# EAGLE board Stealthboard TMC2100 (EAGLE 8.1.0), part 1 of 2
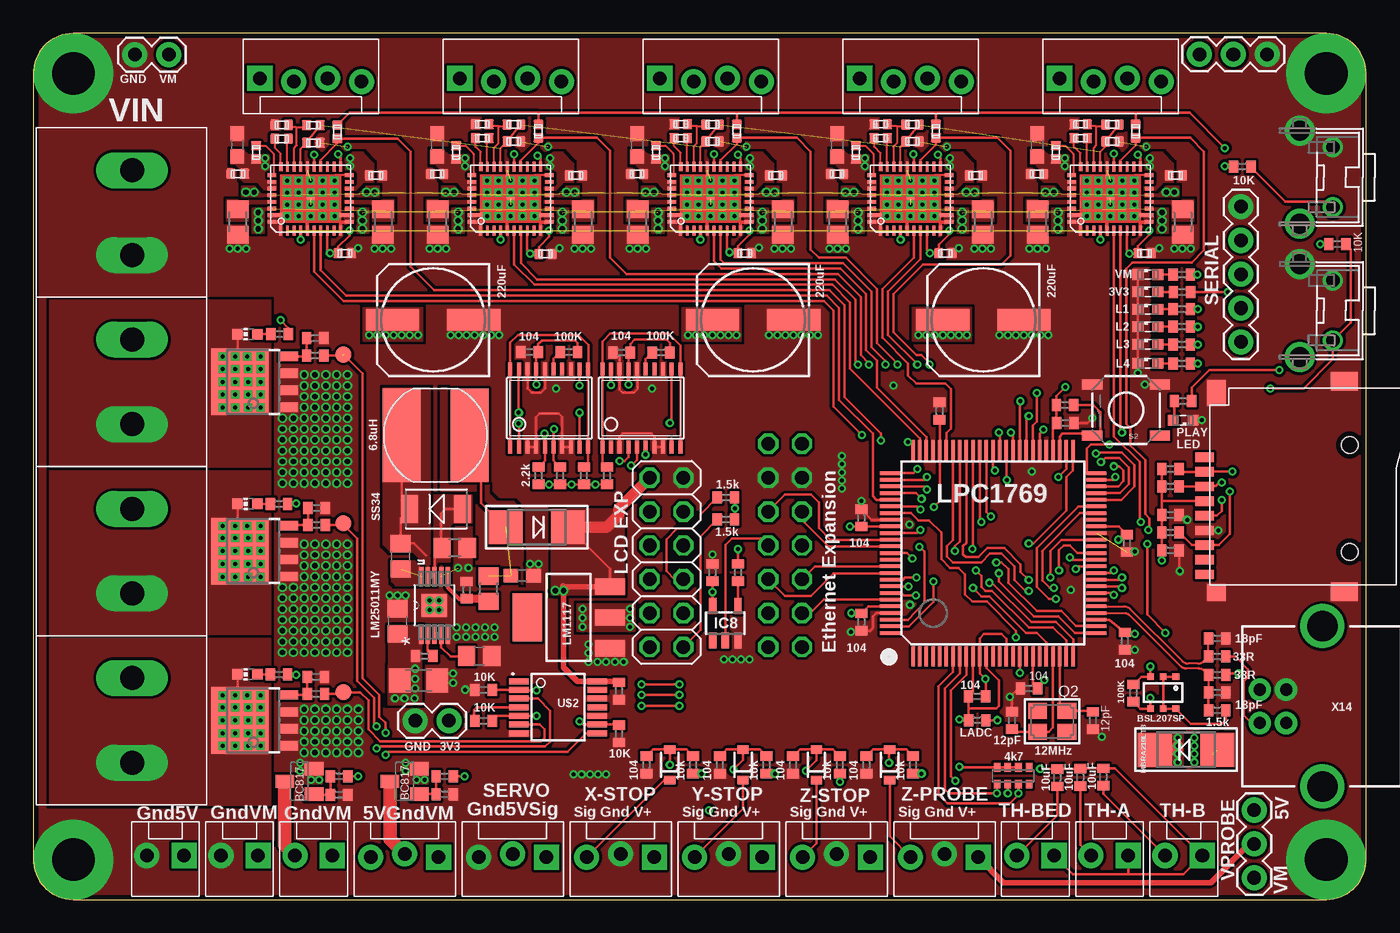
[diagram p8: board, top side]
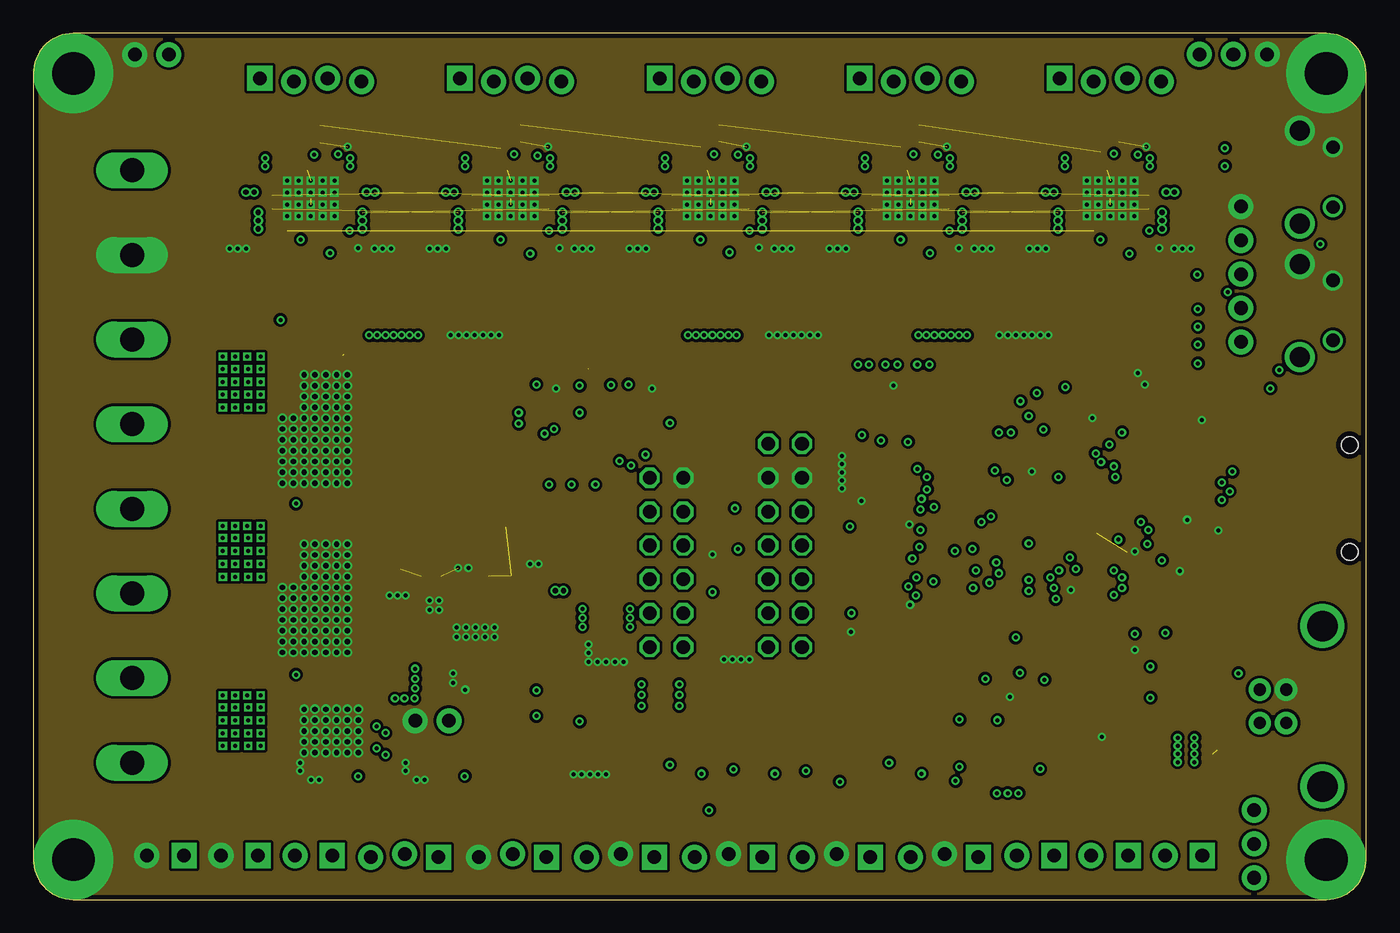
[diagram p9: board, inner layer GND]
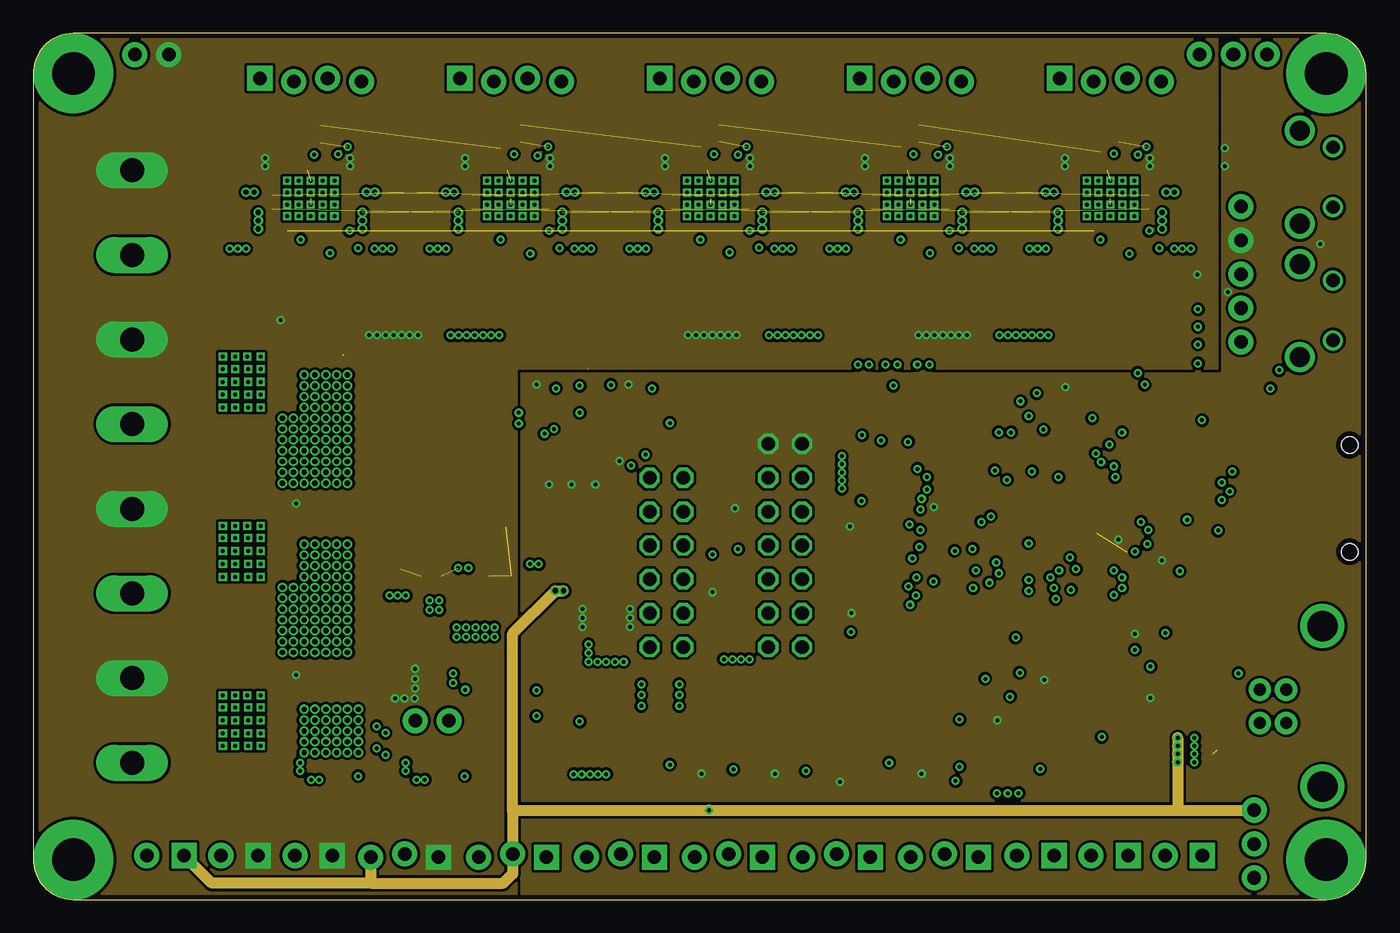
[diagram p10: board, inner layer VCC]
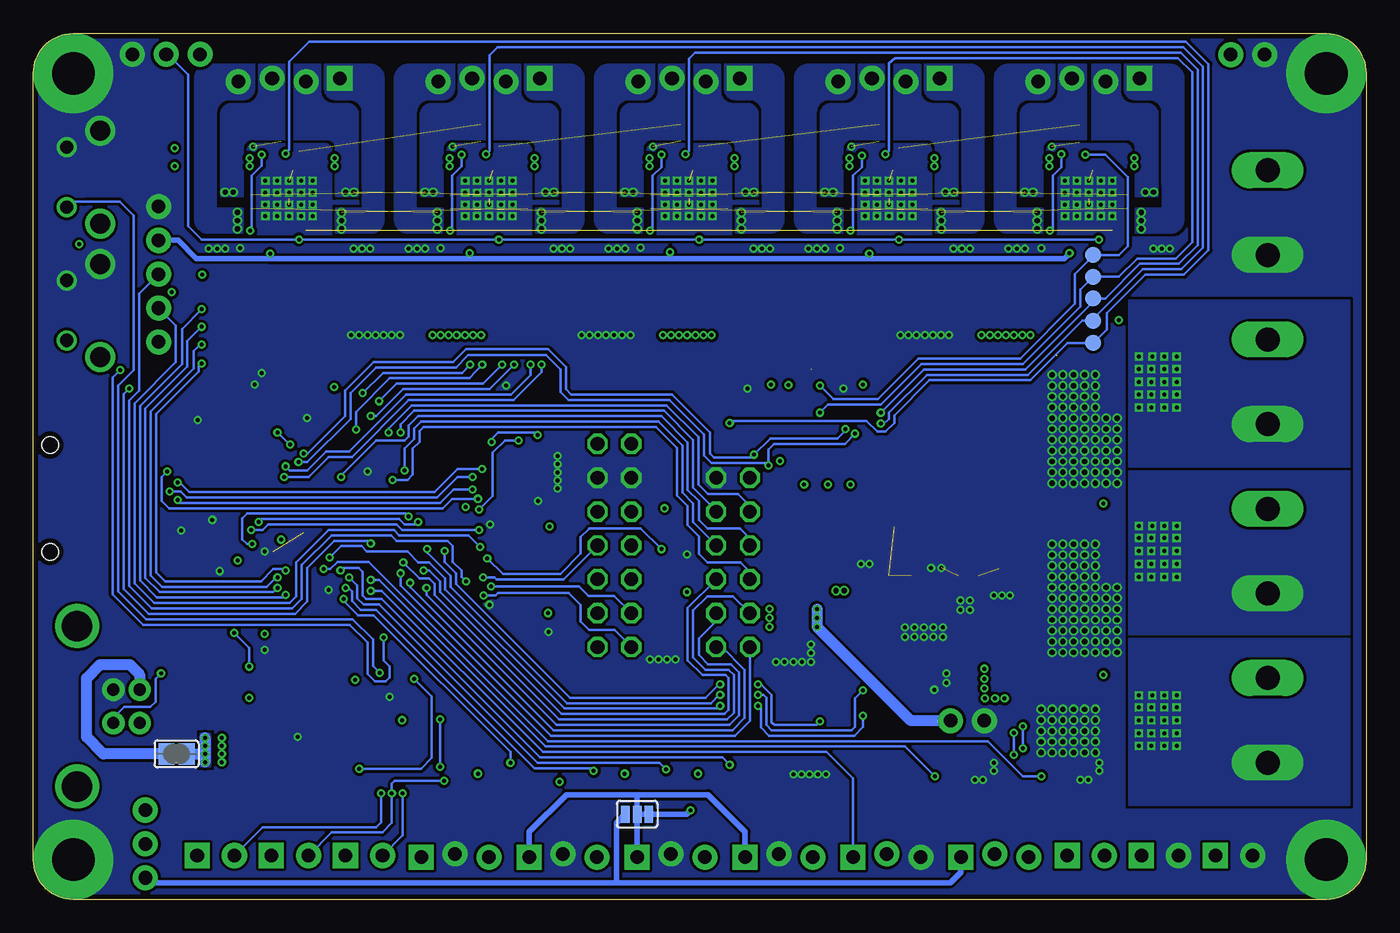
[diagram p11: board, bottom side, seen from below]

Size 100 x 65 mm. Coordinates in mm from the lower left corner, seen from the top.
Outline: 3,0 97,0 arc90 100,3 100,62 arc90 97,65 3,65 arc90 0,62 0,3 arc90 3,0
Copper layers (1*2*15*16): Top 0.035559375mm / dielectric 0.17018125mm / GND 0.01778125mm / dielectric 47mil / VCC 0.01778125mm / dielectric 0.17018125mm / Bottom 0.035559375mm
Design rules "OSHPark-4layer *": minimum track width 6mil, minimum drill 0.3mm, track to track 8mil, track to pad 8mil, pad to pad 6mil, via to via 6mil, smd to smd 0mil, copper to edge 15mil, drill to drill 6mil, minimum pad ring 4mil, minimum via ring 6mil, stop-mask expansion 2.5mil, vias tented up to drill 20mil, thermal gap 10mil
Net classes: 5 3.3-Amp Class: width 1.27 mm

## Footprints (pad centres in the part's own frame; a part is rotated, then mirrored left to right if it is on the bottom)
SML0603 = smd 0.8 x 0.8: A 0.75,0; C -0.75,0
C0402 = smd 0.7 x 0.9: 1 -0.65,0; 2 0.65,0
C0402' = smd 0.75 x 0.7: 1 0,0.5; 2 0,-0.5
C0805 = smd 1.3 x 1.5: 1 -0.95,0; 2 0.95,0
C1206 = smd 1.6 x 1.8: 1 -1.4,0; 2 1.4,0
C0603 = smd 1.1 x 1: 1 -0.85,0; 2 0.85,0
153CLV-0807 = smd 4 x 1.6: + 3.05,0; - -3.05,0
SMADIODE = smd 2.54 x 2.54: A 2.349,0; C -2.349,0
DO-214AC = smd 1.27 x 2.1: 1 -1.98,0; 2 1.98,0
SOD-323 = smd 0.63 x 0.83: A 1.15,0; C -1.15,0
LQFP100 = smd 0.27 x 1.5: 1 -6,-7.75; 2 -5.5,-7.75; 3 -5,-7.75; 4 -4.5,-7.75; 5 -4,-7.75; 6 -3.5,-7.75; 7 -3,-7.75; 8 -2.5,-7.75; 9 -2,-7.75; 10 -1.5,-7.75; 11 -1,-7.75; 12 -0.5,-7.75; 13 0,-7.75; 14 0.5,-7.75; 15 1,-7.75; 16 1.5,-7.75; 17 2,-7.75; 18 2.5,-7.75; 19 3,-7.75; 20 3.5,-7.75; 21 4,-7.75; 22 4.5,-7.75; 23 5,-7.75; 24 5.5,-7.75; 25 6,-7.75; 51 6,7.75; 52 5.5,7.75; 53 5,7.75; 54 4.5,7.75; 55 4,7.75; 56 3.5,7.75; 57 3,7.75; 58 2.5,7.75; 59 2,7.75; 60 1.5,7.75; 61 1,7.75; 62 0.5,7.75; 63 0,7.75; 64 -0.5,7.75; 65 -1,7.75; 66 -1.5,7.75; 67 -2,7.75; 68 -2.5,7.75; 69 -3,7.75; 70 -3.5,7.75; 71 -4,7.75; 72 -4.5,7.75; 73 -5,7.75; 74 -5.5,7.75; 75 -6,7.75 | smd 1.5 x 0.27: 26 7.75,-6; 27 7.75,-5.5; 28 7.75,-5; 29 7.75,-4.5; 30 7.75,-4; 31 7.75,-3.5; 32 7.75,-3; 33 7.75,-2.5; 34 7.75,-2; 35 7.75,-1.5; 36 7.75,-1; 37 7.75,-0.5; 38 7.75,0; 39 7.75,0.5; 40 7.75,1; 41 7.75,1.5; 42 7.75,2; 43 7.75,2.5; 44 7.75,3; 45 7.75,3.5; 46 7.75,4; 47 7.75,4.5; 48 7.75,5; 49 7.75,5.5; 50 7.75,6; 76 -7.75,6; 77 -7.75,5.5; 78 -7.75,5; 79 -7.75,4.5; 80 -7.75,4; 81 -7.75,3.5; 82 -7.75,3; 83 -7.75,2.5; 84 -7.75,2; 85 -7.75,1.5; 86 -7.75,1; 87 -7.75,0.5; 88 -7.75,0; 89 -7.75,-0.5; 90 -7.75,-1; 91 -7.75,-1.5; 92 -7.75,-2; 93 -7.75,-2.5; 94 -7.75,-3; 95 -7.75,-3.5; 96 -7.75,-4; 97 -7.75,-4.5; 98 -7.75,-5; 99 -7.75,-5.5; 100 -7.75,-6
QFN36-PAD = smd 0.7 x 0.26: 1 -2.4,2.25; 2 -2.4,1.75; 3 -2.4,1.25; 4 -2.4,0.75; 5 -2.4,0.25; 6 -2.4,-0.25; 7 -2.4,-0.75; 8 -2.4,-1.25; 9 -2.4,-1.75; 10 -2.4,-2.25; 19 2.4,-2.25; 20 2.4,-1.75; 21 2.4,-1.25; 22 2.4,-0.75; 23 2.4,-0.25; 25 2.4,0.75; 26 2.4,1.25; 27 2.4,1.75; 28 2.4,2.25 | smd 0.26 x 0.7: 11 -1.75,-2.9; 13 -0.75,-2.9; 14 -0.25,-2.9; 15 0.25,-2.9; 16 0.75,-2.9; 17 1.25,-2.9; 18 1.75,-2.9; 29 1.75,2.9; 30 1.25,2.9; 31 0.75,2.9; 32 0.25,2.9; 33 -0.25,2.9; 34 -0.75,2.9; 36 -1.75,2.9 | smd 0.26 x 1.2: 12 -1.25,-2.65; 35 -1.25,2.65 | smd 1.2 x 0.26: 24 2.15,0.25 | smd 0.6 x 0.6: TP 0,0
TSSOP20 = smd 0.305 x 0.991: 1 -2.925,-2.918; 2 -2.275,-2.918; 3 -1.625,-2.918; 4 -0.975,-2.918; 5 -0.325,-2.918; 6 0.325,-2.918; 7 0.975,-2.918; 8 1.625,-2.918; 9 2.275,-2.918; 10 2.925,-2.918; 11 2.925,2.918; 12 2.275,2.918; 13 1.625,2.918; 14 0.975,2.918; 15 0.325,2.918; 16 -0.325,2.918; 17 -0.975,2.918; 18 -1.625,2.918; 19 -2.275,2.918; 20 -2.925,2.918
SOT23-5 = smd 0.55 x 1.2: 1 -0.95,-1.3; 2 0,-1.3; 3 0.95,-1.3; 4 0.95,1.3; 5 -0.95,1.3
CD75 = smd 7 x 2.85: 1 0,2.54; 2 0,-2.54
MOLEX-1X2_LOCK = drill 1.016 pad 1.88 square: 1 -0.127,0 | drill 1.016 pad 1.88: 2 2.667,0
MOLEX-1X3_LOCK = drill 1.016 pad 1.88 square: 1 0,0.127 | drill 1.016 pad 1.88: 2 2.54,-0.127; 3 5.08,0.127
1X05 = drill 1.016 pad 1.88: 1 0,0; 2 2.54,0; 3 5.08,0; 4 7.62,0; 5 10.16,0
1X03 = drill 1.016 pad 1.88: 1 0,0; 2 2.54,0; 3 5.08,0
2X06 = drill 1.016 octagon: 1 -6.35,-1.27; 2 -6.35,1.27; 3 -3.81,-1.27; 4 -3.81,1.27; 5 -1.27,-1.27; 6 -1.27,1.27; 7 1.27,-1.27; 8 1.27,1.27; 9 3.81,-1.27; 10 3.81,1.27; 11 6.35,-1.27; 12 6.35,1.27
MOLEX-1X4_LOCK = drill 1.016 pad 1.88 square: 1 0,0.127 | drill 1.016 pad 1.88: 2 2.54,-0.127; 3 5.08,0.127; 4 7.62,-0.127
1X02 = drill 1.016 pad 1.88: 1 0,0; 2 2.54,0
2X07 = drill 1.016 octagon: 1 -7.62,-1.27; 2 -7.62,1.27; 3 -5.08,-1.27; 4 -5.08,1.27; 5 -2.54,-1.27; 6 -2.54,1.27; 7 0,-1.27; 8 0,1.27; 9 2.54,-1.27; 10 2.54,1.27; 11 5.08,-1.27; 12 5.08,1.27; 13 7.62,-1.27; 14 7.62,1.27
L0402_LPT = smd 0.7 x 0.9: 1 -0.65,0; 2 0.65,0
CHIP-LED0603 = smd 0.8 x 0.8: A 0,-0.75; C 0,0.75
SC74_INFINEON = smd 0.5 x 0.5: 1 -0.95,-1.2; 2 0,-1.2; 3 0.95,-1.2; 4 0.95,1.2; 5 0,1.2; 6 -0.95,1.2
CRYSTAL_3.2X2.5 = smd 1.4 x 1.2: 1 -1.1,-0.8; 2 1.1,0.8; GND1 -1.1,0.8; GND2 1.1,-0.8
SOT669 = smd 0.7 x 1.4: 1 -1.905,-2.65; 2 -0.635,-2.65; 3 0.635,-2.65; 4 1.905,-2.65 | smd 5 x 4.3: MB 0,1
R0402 = smd 0.7 x 0.9: 1 -0.65,0; 2 0.65,0
M0805 = smd 1.3 x 1.6: 1 -0.95,0; 2 0.95,0
R0805 = smd 1.3 x 1.5: 1 -0.95,0; 2 0.95,0
0603-ARV = smd 0.5 x 0.65: 1 -1.2,-0.625; 2 -0.4,-0.625; 3 0.4,-0.625; 4 1.2,-0.625; 5 1.2,0.625; 6 0.4,0.625; 7 -0.4,0.625; 8 -1.2,0.625
TACTILE_SWITCH_SMD = smd 1.524 x 0.762: 1 -2.54,1.905; 2 2.54,1.905; 3 -2.54,-1.905; 4 2.54,-1.905
TF-PULL = smd 0.7 x 1.4: 1 -2.2,-7.62; 2 -1.1,-7.62; 3 0,-7.62; 4 1.1,-7.62; 5 2.2,-7.62; 6 3.3,-7.62; 7 4.4,-7.62; 8 5.5,-7.62; 9 6.6,-7.62 | smd 1.4 x 2: S1 -7.9,2.85; S2 7.9,2.85 | smd 1.28 x 1.4: S3 7.96,-6.75 | smd 1.95 x 1.4: S4 -7.025,-6.75 | hole 1.25: -3.1,3.25; 4.9,3.25
SJ = smd 1.168 x 1.6: 1 -0.762,0; 2 0.762,0
SJ_3 = smd 0.635 x 1.27: 1 -0.889,0; 2 0,0; 3 0.889,0
SW_TACT_STANDARD_RIGHT_ANGLE = drill 1: 1 -2.25,0; 2 2.25,0 | drill 1.5: 3 -3.5,2.5; 4 3.5,2.5
SOT23-BEC = smd 1 x 1.4: B -0.95,-1.1; C 0,1.1; E 0.95,-1.1
SOP50P490X110-11N = smd 1.372 x 0.33: 1 -2.21,0.991; 2 -2.21,0.508; 3 -2.21,0; 4 -2.21,-0.508; 5 -2.21,-0.991; 6 2.21,-0.991; 7 2.21,-0.508; 8 2.21,0; 9 2.21,0.508; 10 2.21,0.991 | smd 1.727 x 1.905: 11 0,0
SOT223 = smd 1.219 x 2.235: 1 -2.311,-3.099; 2 0,-3.099; 3 2.311,-3.099 | smd 3.6 x 2.2: 4 0,3.099
KF635-6.35MM = drill 1.8 long: P$1 7.2,3.175; P$2 7.2,9.525
TSSOP-14 = smd 1.45 x 0.45: 1 -2.95,1.95; 2 -2.95,1.3; 3 -2.95,0.65; 4 -2.95,0; 5 -2.95,-0.65; 6 -2.95,-1.3; 7 -2.95,-1.95; 8 2.95,-1.95; 9 2.95,-1.3; 10 2.95,-0.65; 11 2.95,0; 12 2.95,0.65; 13 2.95,1.3; 14 2.95,1.95
SMALL_PAD = smd 1.2 x 1.2: P$1 0,0
USB-B-PTH = drill 0.914 pad 1.676: D+ 0,1.25; D- 1.981,1.25; GND 0,-1.25; VBUS 1.981,-1.25 | drill 2.286: S1 -2.718,-6.02; S2 -2.718,6.02

## Placement (x,y rotation side)
3V3  RED  [SML0603]  83.62,45.59 0 top
C1  104  [C0402]  46,10.1 90 top
C2  12pF  [C0402]  73.42,13.45 90 top
C3  12pF  [C0402]  79.5,13.43 270 top
C4  18pF  [C0402]  88.82,19.6 180 top
C5  18pF  [C0402]  88.82,15.54 180 top
C6  104  [C0402]  70.81,15.25 0 top
C7  104  [C0402]  62.12,20.82 90 top
C8  104  [C0402]  85.32,28.86 180 top
C9  104  [C0402]  77.41,35.76 180 top
C10  104  [C0402]  74.71,15.84 0 top
C11  104  [C0402]  82.05,26.73 90 top
C12  104  [C0402]  62.12,28.64 270 top
C13  100n/50V  [C0402']  15.34,54.46 270 top
C14  10uF  [C0402]  76.82,9.15 90 top
C15  10uF  [C0402]  80.27,9.2 90 top
C16  1uF  [C0805]  27.33,20.88 90 top
C17  104  [C0402]  81.88,19.39 90 top
C19  104  [C0402]  51.5,10.1 90 top
C20  104  [C0402]  67.98,36.66 270 top
C21  104  [C0402]  57,10.1 90 top
C22  104  [C0402]  62.5,10.1 90 top
C23  2.2uF  [C1206]  28.91,16.46 0 top
C24  104  [C0805]  33.45,18.26 180 top
C25  104  [C0805]  27.56,25.76 90 top
C26  10uF  [C0603]  36.68,24.31 0 top
C27  1u/50V  [C0603]  15.31,56.62 90 top
C28  100n/50V  [C0402']  23.38,48.49 270 top
C29  470n/10V  [C0402']  18.63,58.13 90 top
C30  4u7/10V  [C0402']  21.01,56.79 270 top
C32  100n/50V  [C0402']  25.71,54.34 90 top
C33  100n/50V  [C0402']  16.71,56.07 180 top
C34  22n/50V  [C0402']  18.63,57.08 270 top
C35  1u/50V  [C0603]  30.31,56.62 90 top
C36  220uF  [153CLV-0807]  30,43.5 180 top
C37  220uF  [153CLV-0807]  54,43.5 180 top
C38  220uF  [153CLV-0807]  71.27,43.5 180 top
C39  100n/50V  [C0402']  38.43,48.44 270 top
C40  470n/10V  [C0402']  33.68,58.18 90 top
C41  4u7/10V  [C0402']  36.06,56.89 270 top
C42  100n/50V  [C0402']  30.3,54.44 270 top
C43  100n/50V  [C0402']  40.71,54.34 90 top
C44  100n/50V  [C0402']  31.71,56.07 180 top
C45  10uF  [C0402]  78.54,9.17 90 top
C46  22n/50V  [C0402']  33.68,57.13 270 top
C47  1u/50V  [C0603]  45.31,56.62 90 top
C48  100n/50V  [C0402']  53.38,48.5 270 top
C49  470n/10V  [C0402']  48.57,58.18 90 top
C50  4u7/10V  [C0402']  50.96,56.89 270 top
C51  100n/50V  [C0402']  45.3,54.44 270 top
C52  100n/50V  [C0402']  55.71,54.34 90 top
C53  100n/50V  [C0402']  46.71,56.07 180 top
C54  22n/50V  [C0402']  48.57,57.14 270 top
C55  1u/50V  [C0603]  60.31,56.62 90 top
C56  100n/50V  [C0402']  68.43,48.49 270 top
C57  470n/10V  [C0402']  63.57,58.18 90 top
C58  4u7/10V  [C0402']  65.96,56.89 270 top
C59  100n/50V  [C0402']  60.3,54.44 270 top
C60  100n/50V  [C0402']  70.71,54.34 90 top
C61  100n/50V  [C0402']  61.71,56.07 180 top
C62  22n/50V  [C0402']  63.57,57.13 270 top
C63  1u/50V  [C0603]  75.31,56.62 90 top
C64  100n/50V  [C0402']  83.38,48.49 270 top
C65  470n/10V  [C0402']  78.57,58.18 90 top
C66  4u7/10V  [C0402']  80.96,56.89 270 top
C67  10uF  [C0402]  85.32,26.2 180 top
C68  100n/50V  [C0402']  75.3,54.44 270 top
C69  100n/50V  [C0402']  85.71,54.34 90 top
C70  104  [C0402]  43.94,15.65 270 top
C71  100n/50V  [C0402']  76.71,56.07 180 top
C72  22n/50V  [C0402']  78.57,57.13 270 top
C73  104  [C0402]  37.24,41.1 0 top
C74  104  [C0402]  44.15,41.05 0 top
C75  104  [C0402]  50.95,24.54 90 top
D1  MBRA210LT3  [SMADIODE]  86.49,11.24 0 top
D2  SS34  [DO-214AC]  30.23,29.31 0 top
D3  MBRA210LT3  [SMADIODE]  37.78,27.94 180 top
D7  1N4148  [SOD-323]  47.75,10.1 90 top
D9  1N4148  [SOD-323]  53.25,10.1 90 top
D11  1N4148  [SOD-323]  58.75,10.1 90 top
D12  1N4148  [SOD-323]  64.25,10.1 90 top
IC1  LPC1769  [LQFP100]  72,26 0 top
IC2  TMC2100-LA  [QFN36-PAD]  20.81,52.6 90 top
IC3  TMC2100-LA  [QFN36-PAD]  35.81,52.6 90 top
IC4  TMC2100-LA  [QFN36-PAD]  50.81,52.6 90 top
IC5  TMC2100-LA  [QFN36-PAD]  65.81,52.6 90 top
IC6  TMC2100-LA  [QFN36-PAD]  80.81,52.6 90 top
IC7  MCP44X1  [TSSOP20]  38.71,36.88 0 top
IC8  74LVC1G04  [SOT23-5]  51.92,20.73 0 top
IC9  MCP44X1  [TSSOP20]  45.62,36.88 0 top
INDUCTOR2  6.8uH  [CD75]  30.18,34.85 270 top
J1  [MOLEX-1X2_LOCK]  11.18,3.3 180 top
J2  [MOLEX-1X3_LOCK]  70.9,3.3 180 top
J3  [1X05]  90.6,52 270 top
J4  [1X03]  91.59,6.71 270 top
J5  [MOLEX-1X3_LOCK]  62.8,3.3 180 top
J6  [MOLEX-1X2_LOCK]  16.74,3.3 180 top
J7  [2X06]  47.51,25.3 270 top
J8  [MOLEX-1X4_LOCK]  17,61.5 0 top
J9  [MOLEX-1X3_LOCK]  54.7,3.3 180 top
J10  [MOLEX-1X2_LOCK]  22.3,3.3 180 top
J11  [MOLEX-1X3_LOCK]  46.6,3.3 180 top
J12  [MOLEX-1X2_LOCK]  82.02,3.3 180 top
J13  [MOLEX-1X2_LOCK]  76.46,3.3 180 top
J14  [MOLEX-1X2_LOCK]  87.58,3.3 180 top
J15  [MOLEX-1X4_LOCK]  32,61.5 0 top
J16  [MOLEX-1X3_LOCK]  30.4,3.3 180 top
J17  [MOLEX-1X4_LOCK]  47,61.5 0 top
J18  [MOLEX-1X4_LOCK]  62,61.5 0 top
J19  [MOLEX-1X4_LOCK]  77,61.5 0 top
J20  [1X03]  87.49,63.43 0 top
J21  [1X02]  10.16,63.4 180 top
J22  [1X02]  31.19,13.41 180 top
JP4  [MOLEX-1X3_LOCK]  38.5,3.3 180 top
JP20  [2X07]  56.4,26.57 270 bottom
L1  GREEN  [SML0603]  83.62,44.3 0 top
L2  GREEN  [SML0603]  83.62,42.98 0 top
L3  GREEN  [SML0603]  83.62,41.66 0 top
L4  GREEN  [SML0603]  83.62,40.23 0 top
LADC  LADC  [L0402_LPT]  70.82,13.46 180 top
LED6  RED  [CHIP-LED0603]  16.06,42.42 90 top
LED7  RED  [CHIP-LED0603]  16.06,29.69 90 top
LED8  RED  [CHIP-LED0603]  16.06,16.9 90 top
LED10  GREEN  [SML0603]  86.26,35.97 180 top
Q1  BSL207SP  [SC74_INFINEON]  84.76,15.52 180 top
Q2  12MHz  [CRYSTAL_3.2X2.5]  76.45,13.37 180 top
Q3  PH7030L  [SOT669]  16.5,38.85 90 top
Q4  PH7030L  [SOT669]  16.5,13.45 90 top
Q5  PH7030L  [SOT669]  16.5,26.15 90 top
R1  10K  [R0402]  85.32,32.29 180 top
R2  10K  [R0402]  85.32,27.54 180 top
R3  10K  [R0402]  85.32,31 180 top
R4  10K  [R0402]  43.94,12.45 90 top
R5  R0805/0R11  [M0805]  26.23,50.84 90 top
R6  R0805/0R11  [M0805]  15.34,50.84 90 top
R7  1.5k  [R0402]  88.82,14.2 0 top
R8  33R  [R0402]  88.82,16.86 180 top
R9  33R  [R0402]  88.82,18.23 180 top
R10  10k  [R0402]  66,10.1 90 top
R11  10K  [R0402]  33.78,13.41 180 top
R12  1k  [R0402]  86.16,44.3 0 top
R13  1k  [R0402]  86.16,42.98 0 top
R14  10k  [R0402]  60.5,10.1 90 top
R16  2R2  [C0402']  21.01,58.1 90 top
R18  105K  [R0402]  29.34,18.26 180 top
R19  10K  [R0402]  32.51,23.22 90 top
R20  50M  [R0805]  31.62,26.39 180 top
R21  10r  [R0402]  22.95,9.26 180 top
R22  10k  [R0402]  55,10.1 90 top
R23  100k  [R0402]  22.95,7.87 180 top
R24  10k  [R0402]  49.5,10.1 90 top
R25  9.76k  [R0805]  34.16,23.32 90 top
R26  R0805/0R11  [M0805]  41.23,50.84 90 top
R27  R0805/0R11  [M0805]  30.34,50.84 90 top
R28  2R2  [C0402']  36.06,58.15 90 top
R29  R0805/0R11  [M0805]  56.23,50.84 90 top
R30  R0805/0R11  [M0805]  45.34,50.84 90 top
R31  2R2  [C0402']  50.96,58.16 90 top
R32  R0805/0R11  [M0805]  71.23,50.84 90 top
R34  R0805/0R11  [M0805]  60.34,50.84 90 top
R35  2R2  [C0402']  65.96,58.15 90 top
R36  R0805/0R11  [M0805]  86.23,50.84 90 top
R37  10r  [R0402]  30.87,9.24 180 top
R38  R0805/0R11  [M0805]  75.34,50.84 90 top
R39  2R2  [C0402']  80.96,58.15 90 top
R40  100K  [R0402]  40.18,41.1 0 top
R41  [R0402]  41.3,31.8 270 top
R42  100k  [R0402]  30.87,7.9 180 top
R43  2.2k  [R0402]  39.52,31.8 270 top
R44  2.2k  [R0402]  37.9,31.8 270 top
R45  100K  [R0402]  47.09,41.05 0 top
R46  [R0402]  43.03,31.8 270 top
R47  10r  [R0402]  21.26,28.11 180 top
R48  100k  [R0402]  21.26,29.38 180 top
R49  1k  [R0402]  86.16,41.66 0 top
R50  10r  [R0402]  21.21,15.42 180 top
R51  100k  [R0402]  21.21,16.71 180 top
R52  10K  [R0402]  90.7,55 180 top
R53  10K  [R0402]  77.4,37.11 180 top
R54  10K  [R0402]  97.84,49.17 180 top
R55  10r  [R0402]  21.16,40.83 180 top
R56  1.5k  [R0402]  51.96,28.52 180 top
R57  1.5k  [R0402]  51.96,30.15 0 top
R58  100K  [R0402]  82.54,15.49 270 top
R59  10K  [R0402]  33.78,15.75 180 top
R60  100k  [R0402]  21.16,42.12 180 top
R61  1.5k  [R0402]  18.48,42.42 0 top
R62  1.5k  [R0402]  18.43,29.68 0 top
R63  1.5k  [R0402]  18.43,16.88 0 top
R64  1k  [R0402]  86.16,40.23 0 top
R65  10k  [C0402']  22.81,57.61 180 top
R66  10k  [C0402']  37.9,57.66 180 top
R67  10k  [C0402']  52.78,57.66 180 top
R68  10k  [C0402']  67.72,57.66 180 top
R69  10k  [C0402']  82.7,57.66 180 top
R70  22R  [R0402]  52.88,24.54 90 top
R71  1k  [R0402]  86.18,45.59 0 top
R72  1.5K  [R0402]  86.16,46.89 0 top
R73  1k  [R0402]  86.26,37.39 0 top
RN2  4k7  [0603-ARV]  73.51,9.3 0 top
S2  [TACTILE_SWITCH_SMD]  81.98,36.73 180 top
SD1  TF-HOLDER  [TF-PULL]  95.5,31 270 top
SJ1  [SJ]  89.26,10.92 180 bottom
SJ26  [SJ_3]  54.7,6.4 180 bottom
SW1  SW_TACT_4P_B  [SW_TACT_STANDARD_RIGHT_ANGLE]  97.5,54.2 90 top
SW3  SW_TACT_4P_B  [SW_TACT_STANDARD_RIGHT_ANGLE]  97.5,44.2 90 top
T1  BC817  [SOT23-BEC]  19.96,8.87 90 top
T2  BC817  [SOT23-BEC]  27.86,8.87 90 top
U1  LM25011MY  [SOP50P490X110-11N]  30.1,22.07 90 top
U2  LM1117  [SOT223]  40.17,21.17 90 top
U$1  KF635-6.35MM-2PKF635-2P  [KF635-6.35MM]  0.2,19.8 0 top
U$2  MC74VHCT125ADTRG  [TSSOP-14]  39.37,14.43 0 top
U$4  KF635-6.35MM-2PKF635-2P  [KF635-6.35MM]  0.2,32.5 0 top
U$5  KF635-6.35MM-2PKF635-2P  [KF635-6.35MM]  0.2,45.2 0 top
U$6  KF635-6.35MM-2PKF635-2P  [KF635-6.35MM]  0.2,7.1 0 top
U$7  SMALL_PAD  [SMALL_PAD]  23.27,28.24 0 top
U$8  SMALL_PAD  [SMALL_PAD]  20.47,48.36 0 bottom
U$9  SMALL_PAD  [SMALL_PAD]  20.47,46.74 0 bottom
U$10  SMALL_PAD  [SMALL_PAD]  20.47,45.11 0 bottom
U$11  SMALL_PAD  [SMALL_PAD]  20.47,43.43 0 bottom
U$12  SMALL_PAD  [SMALL_PAD]  20.47,41.76 0 bottom
U$13  SMALL_PAD  [SMALL_PAD]  23.27,15.54 0 top
U$14  SMALL_PAD  [SMALL_PAD]  23.27,40.89 0 top
VM  RED  [SML0603]  83.62,46.89 0 top
X14  USBPTH  [USB-B-PTH]  94,14.5 180 top